# EAGLE design Noduino-Falcon (EAGLE 6.6.0)
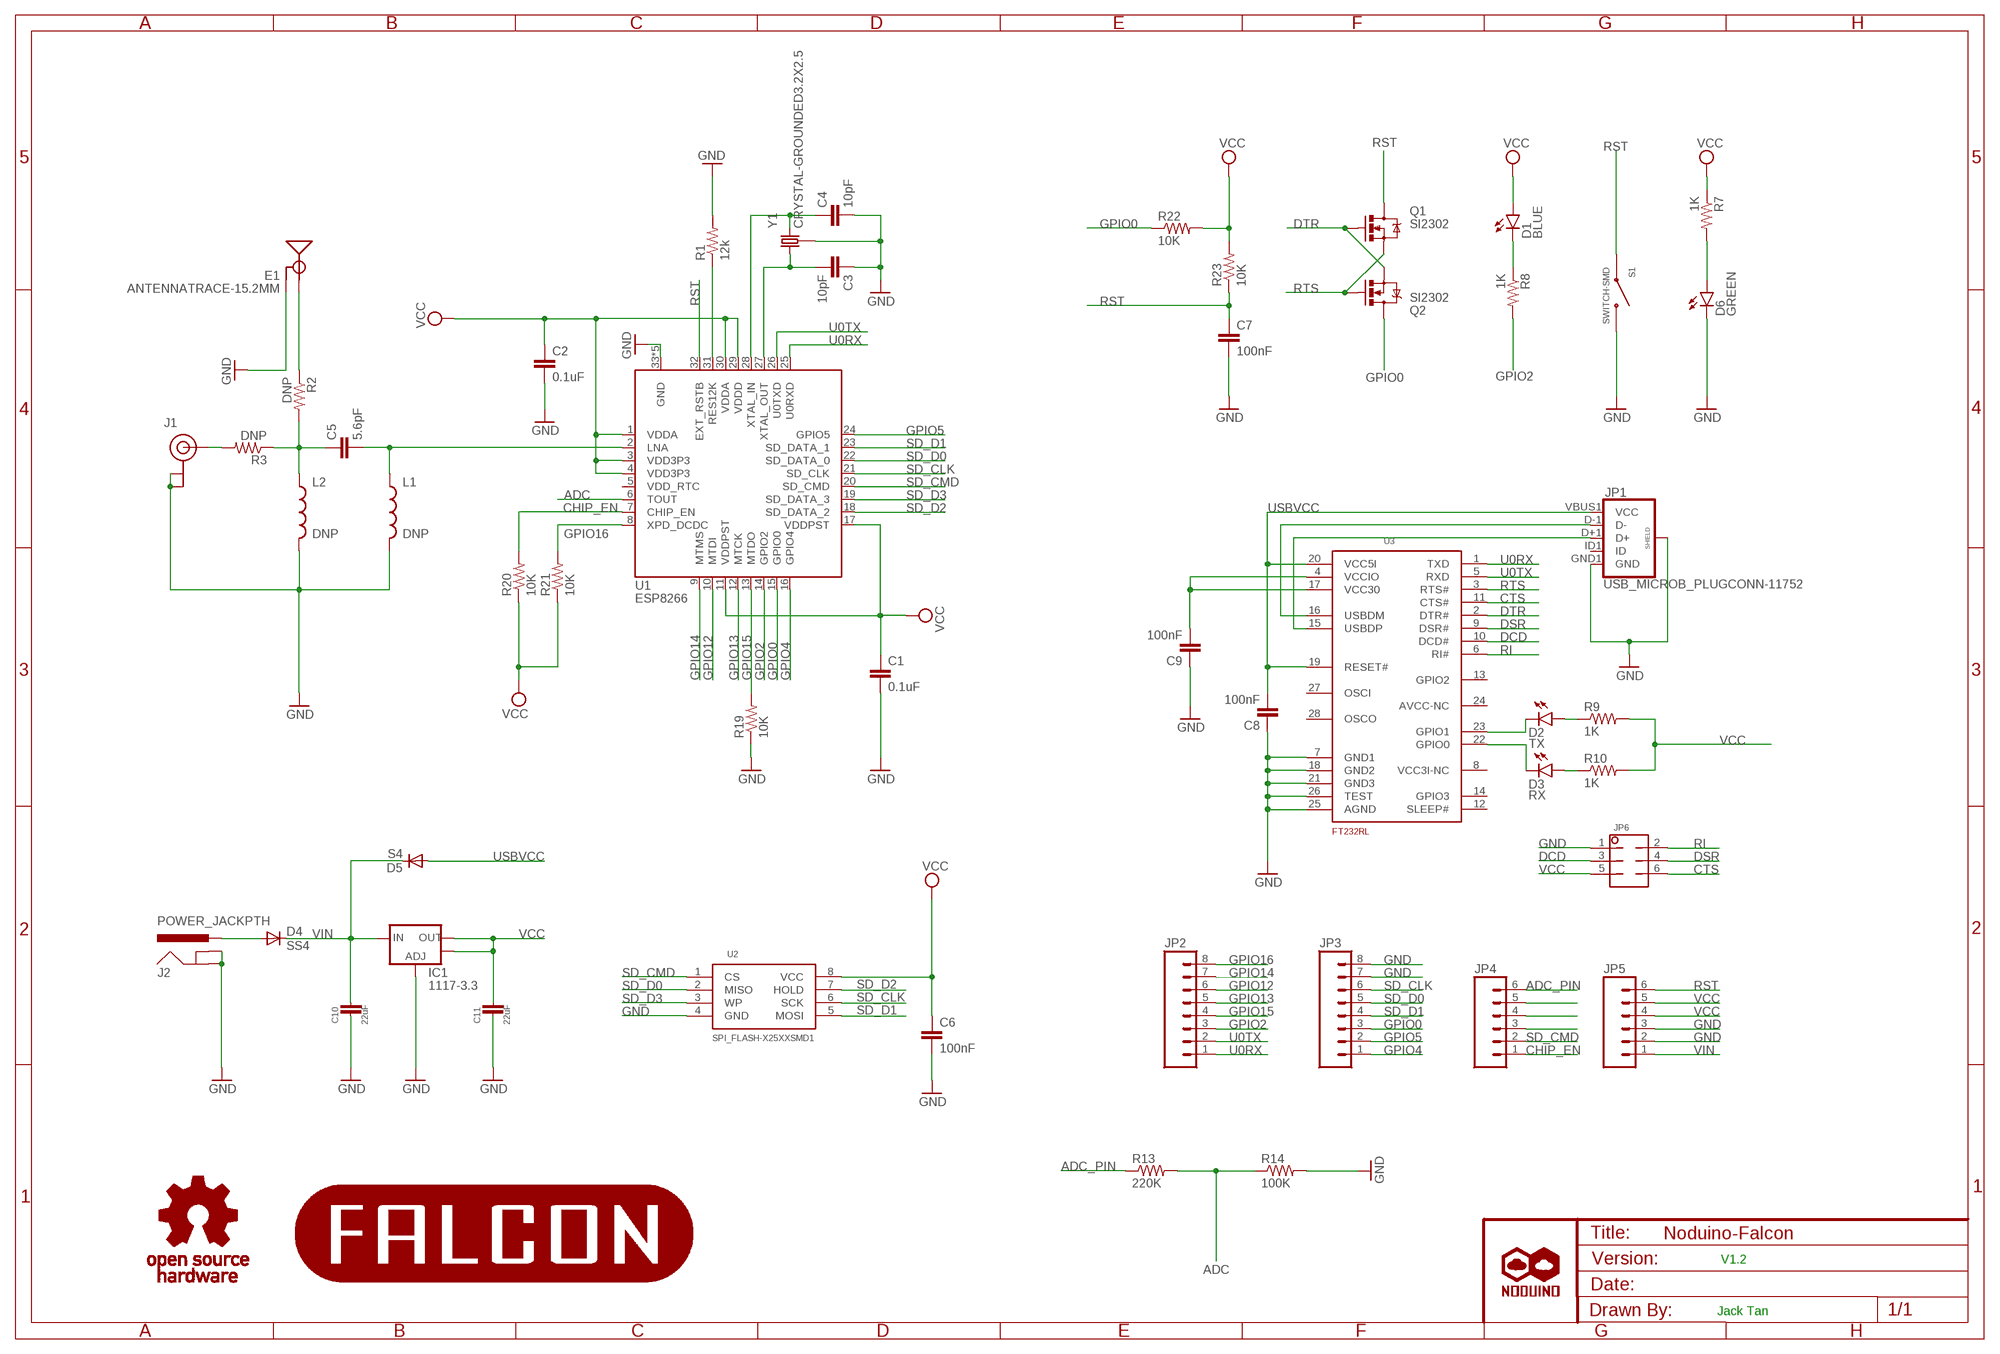
[diagram p0: schematic, sheet 1]

## Parts
C1  0.1uF  0.1UF-25V(+80/-20%)(0603)  [0603-CAP]
C2  0.1uF  0.1UF-25V(+80/-20%)(0603)  [0603-CAP]
C3  10pF  10PF-50V-5%(0603)  [0603-CAP]
C4  10pF  10PF-50V-5%(0603)  [0603-CAP]
C5  5.6pF  CAP0603-CAP  [0603-CAP]
C6  100nF  CAP0603-CAP  [0603-CAP]
C7  100nF  CAP0603-CAP  [0603-CAP]
C8  100nF  CAP0603-CAP  [0603-CAP]
C9  100nF  CAP0603-CAP  [0603-CAP]
C10  22uF  CAP-C1206  [C1206]
C11  22uF  CAP-C1206  [C1206]
D1  BLUE  LED-GREEN0603  [LED-0603]
D2  TX  LED-GREEN0603  [LED-0603]
D3  RX  LED-YELLOW0603  [LED-0603]
D4  SS4  DIODESMB  [SMB-DIODE]
D5  S4  DIODESOD  [SOD-323]
D6  GREEN  LED-GREEN0603  [LED-0603]
E1  ANTENNATRACE-15.2MM  [TRACE_ANTENNA_2.4GHZ_15.2MM]
IC1  1117-3.3  AMS1117SOT223  [SOT223]
J1  U.FL  [U.FL]
J2  POWER_JACKPTH  [POWER_JACK_PTH]
JP1  USB_MICROB_PLUGCONN-11752  [USB-B-MICRO-SMD_V03]
JP2  M081X08  [1X08]
JP3  M081X08  [1X08]
JP4  M06SIP  [1X06]
JP5  M06SIP  [1X06]
JP6  M02X3  [2X3]
L1  DNP  INDUCTOR0603  [0603]
L2  DNP  INDUCTOR0603  [0603]
Q1  SI2302  -MOSFET-N-SMD  [SOT23-3]
Q2  SI2302  -MOSFET-N-SMD  [SOT23-3]
R1  12k  12KOHM-1/10W-1%(0603)  [0603-RES]
R2  DNP  RESISTOR0603-RES  [0603-RES]
R3  DNP  RESISTOR0603-RES  [0603-RES]
R7  1K  RESISTOR0603-RES  [0603-RES]
R8  1K  RESISTOR0603-RES  [0603-RES]
R9  1K  RESISTOR0603-RES  [0603-RES]
R10  1K  RESISTOR0603-RES  [0603-RES]
R13  220K  RESISTOR0603-RES  [0603-RES]
R14  100K  RESISTOR0603-RES  [0603-RES]
R19  10K  RESISTOR0603-RES  [0603-RES]
R20  10K  10KOHM1/10W1%(0603)0603  [0603-RES]
R21  10K  10KOHM1/10W1%(0603)0603  [0603-RES]
R22  10K  RESISTOR0603-RES  [0603-RES]
R23  10K  RESISTOR0603-RES  [0603-RES]
S1  SWITCH-SMD  [TACTILE-SWITCH-1101NE]
U1  ESP8266  [QFN-32]
U2  SPI_FLASH-X25XXSMD1  [SO08-EIAJ]
U3  FT232RL  [SSOP28]
U$1  NODUINO-LOGO-ALL  [NODUINO-ALL-1]
U$2  NODUINO-FALCON  [NODUINO-FALCON]
U$3  OPEN_HARDWARE_LOGO  [OPEN_HARDWARE_LOGO]
Y1  CRYSTAL-GROUNDED3.2X2.5  [CRYSTAL-SMD-3.2X2.5]

## Nets
ADC: R13.2 R14.1 U1.6(TOUT)
ADC_PIN: JP4.6 R13.1
CHIP_EN: JP4.1 R20.2 U1.7(CHIP_EN)
CTS: JP6.6 U3.11(CTS#)
DCD: JP6.3 U3.10(DCD#)
DSR: JP6.4 U3.9(DSR#)
DTR: Q1.1(G) Q2.2(S) U3.2(DTR#)
GND: C1.2 C2.2 C3.1 C4.2 C6.2 C7.2 C8.1 C9.1 C10.2 C11.2 D6.C E1.GND IC1.1(ADJ) J1.P$1(GND) J1.P$2(GND) J2.GND J2.GNDBREAK JP1.GND1(GND) JP1.SHIELD1(SHIELD) JP1.SHIELD2(SHIELD) JP1.SHIELD3(SHIELD) JP3.7 JP3.8 JP5.2 JP5.3 JP6.1 L1.2 L2.2 R1.2 R14.2 R19.1 S1.P$1 U1.33(GND) U1.34(GND) U1.35(GND) U1.36(GND) U1.37(GND) U2.4(GND) U3.7(GND1) U3.18(GND2) U3.21(GND3) U3.25(AGND) U3.26(TEST) Y1.2(GND) Y1.4(GND)
GPIO0: JP3.3 Q2.3(D) R22.1 U1.15(GPIO0)
GPIO2: JP2.3 R8.2 U1.14(GPIO2)
GPIO4: JP3.1 U1.16(GPIO4)
GPIO5: JP3.2 U1.24(GPIO5)
GPIO12: JP2.6 U1.10(MTDI)
GPIO13: JP2.5 U1.12(MTCK)
GPIO14: JP2.7 U1.9(MTMS)
GPIO15: JP2.4 R19.2 U1.13(MTDO)
GPIO16: JP2.8 R21.2 U1.8(XPD_DCDC)
LNA: C5.2 L1.1 U1.2(LNA)
N$1: D1.C R8.1
N$2: C4.1 U1.28(XTAL_IN) Y1.3
N$3: C3.2 U1.27(XTAL_OUT) Y1.1
N$4: JP1.D-1(D-) U3.16(USBDM)
N$5: JP1.D+1(D+) U3.15(USBDP)
N$6: C9.2 U3.4(VCCIO) U3.17(VCC30)
N$7: E1.ANT(SIGNAL) R2.1
N$8: D2.C U3.23(GPIO1)
N$9: D3.C U3.22(GPIO0)
N$10: D2.A R9.1
N$11: D3.A R10.1
N$12: JP4.5
N$13: D6.A R7.2
N$14: JP4.4
N$15: JP4.3
N$16: D4.A J2.PWR
N$17: R1.1 U1.31(RES12K)
N$20: C5.1 L2.1 R2.2 R3.1
N$22: J1.P$3(SIGNAL) R3.2
RI: JP6.2 U3.6(RI#)
RST: C7.1 JP5.6 Q1.3(D) R23.1 S1.P$2 U1.32(EXT_RSTB)
RTS: Q1.2(S) Q2.1(G) U3.3(RTS#)
SD_CLK: JP3.6 U1.21(SD_CLK) U2.6(SCK)
SD_CMD: JP4.2 U1.20(SD_CMD) U2.1(CS)
SD_D0: JP3.5 U1.22(SD_DATA_0) U2.2(MISO)
SD_D1: JP3.4 U1.23(SD_DATA_1) U2.5(MOSI)
SD_D2: U1.18(SD_DATA_2) U2.7(HOLD)
SD_D3: U1.19(SD_DATA_3) U2.3(WP)
U0RX: JP2.1 U1.25(U0RXD) U3.1(TXD)
U0TX: JP2.2 U1.26(U0TXD) U3.5(RXD)
USBVCC: C8.2 D5.2(A) JP1.VBUS1(VCC) U3.19(RESET#) U3.20(VCC5I)
VCC: C1.1 C2.1 C6.1 C11.1 D1.A IC1.2(OUT) IC1.4(OUT) JP5.4 JP5.5 JP6.5 R7.1 R9.2 R10.2 R20.1 R21.1 R22.2 R23.2 U1.1(VDDA) U1.3(VDD3P3) U1.4(VDD3P3) U1.11(VDDPST) U1.17(VDDPST) U1.29(VDDD) U1.30(VDDA) U2.8(VCC)
VIN: C10.1 D4.C D5.1(C) IC1.3(IN) JP5.1
Unconnected: JP1.ID1(ID) U1.5(VDD_RTC) U3.8(VCC3I-NC) U3.12(SLEEP#) U3.13(GPIO2) U3.14(GPIO3) U3.24(AVCC-NC) U3.27(OSCI) U3.28(OSCO)

## Notes on the sheet
- V1.2
- Jack Tan

## Library data of the parts
C1 C2 = SparkFun_ESP8266_Thing:0.1UF-25V(+80/-20%)(0603): CAP-00810 Ceramic Standard decoupling cap; PROD_ID: CAP-00810
C3 C4 = SparkFun_ESP8266_Thing:10PF-50V-5%(0603): CAP-11812; PROD_ID: CAP-11812
C5-C9 = SparkFun_ESP8266_Thing:CAP: Capacitor Standard 0603 ceramic capacitor, and 0.1" leaded capacitor.
C10 C11 = digital-toy:CAP: Capacitor Standard 0603 ceramic capacitor, and 0.1" leaded capacitor.
D1 D2 = SparkFun_ESP8266_Thing:LED-GREEN: Various green LEDs Green LEDs used in SFE Production 0603- DIO-00821 LARGE- DIO-00862 LILYPAD- DIO-09910; PROD_ID: DIO-00821; VALUE: GREEN
D3 = SparkFun_ESP8266_Thing:LED-YELLOW: Yellow SMD LEDs LilyPad 1206- DIO-09909 0603- DIO-09003; PROD_ID: DIO-09003
D4 D5 = ehl:DIODE: Diode These are standard reverse protection diodes and small signal diodes. SMA package can handle up to about 1A. SOD-323 can handle about 200mA. What the SOD-323 package when ordering, there are some mfgs out there that are 5-pin packages.
D6 = SparkFun_ESP8266_Thing:LED-GREEN: Various green LEDs Green LEDs used in SFE Production 0603- DIO-00821 LARGE- DIO-00862 LILYPAD- DIO-09910; PROD_ID: DIO-00821
E1 = SparkFun_ESP8266_Thing:ANTENNA: Chip antenna Chip antenna with ground or secondary connection. Common with larger metal RF connectors.
IC1 = ehl:AMS1117: Voltage Regulator LM1117 Standard adjustable voltage regulator but in SMD form. Spark Fun Electronics SKU : COM-00595
J1 = SparkFun_ESP8266_Thing:U.FL: SMD antenna connector- WRL-09144; PROD_ID: CONN-09193
J2 = ehl:POWER_JACK: Power Jack This is the standard 5.5mm barrel jack for power. The PTH is the most common, proven, reliable, footprint. All others are experimental. The Slot footprint only works if the mill layer is transmitted to the PCB fab house so be warned. Spark Fun Electronics SKU : PRT-00119. Mating wall wart : TOL-00298 (and others)
JP1 = ehl:USB_MICROB_PLUG: USB Micro-B connectors Some male, some female. Watch your step!; PROD_ID: CONN-11752
JP2 JP3 = ehl:M08: Header 8 Standard 8-pin 0.1" header. Use with straight break away headers (SKU : PRT-00116), right angle break away headers (PRT-00553), swiss pins (PRT-00743), machine pins (PRT-00117), and female headers (PRT-00115).
JP4 JP5 = ehl:M06: Header 6 Standard 6-pin 0.1" header. Use with straight break away headers (SKU : PRT-00116), right angle break away headers (PRT-00553), swiss pins (PRT-00743), machine pins (PRT-00117), and female headers (PRT-00115). Molex polarized connector foot print use with SKU : PRT-08094 with associated crimp pins and housings. NOTES ON THE VARIANTS LOCK and LOCK_LONGPADS... This footprint was designed to help hold the alignment of a through-hole component (i.e. 6-pin header) while soldering it into place. You may notice that each hole has been shifted either up or down by 0.005 of an inch from it's more standard position (which is a perfectly straight line). This slight alteration caused the pins (the squares in the middle) to touch the edges of the holes. Because they are alternating, it causes a "brace" to hold the component in place. 0.005 has proven to be the perfect amount of "off-center" position when using our standard breakaway headers. Although looks a little odd when you look at the bare footprint, once you have a header in there, the alteration is very hard to notice. Also, if you push a header all the way into place, it is covered up entirely on the bottom side. This idea of altering the position of holes to aid alignment will be further integrated into the Sparkfun Library for other footprints. It can help hold any component with 3 or more connection pins.
JP6 = ehl:M02X3
L1 L2 = SparkFun_ESP8266_Thing:INDUCTOR: Inductors Basic Inductor/Choke - 0603 and 1206. Footprints are not proven and vary greatly between part numbers. SRN6045- 33uH, 20% 1.4A SDR0403-560KL - 56uH, 10%, 500mA RMS/740mA peak
Q1 Q2 = digital-toy:*-MOSFET-N
R1 = SparkFun_ESP8266_Thing:12KOHM-1/10W-1%(0603): RES-10327; PROD_ID: RES-10327
R2 R3 R7-R10 R13 R14 R19 R22 R23 = SparkFun_ESP8266_Thing:RESISTOR: Resistor Basic schematic elements and footprints for 0603, 1206, and PTH resistors.
R20 R21 = SparkFun_ESP8266_Thing:10KOHM1/10W1%(0603): RES-00824; PROD_ID: RES-00824
S1 = ehl:SWITCH-SMD
U1 = ehl:ESP8266
U2 = ehl:SPI_FLASH-X25XX: 8pin SPI Flash series x25xx. Works with devices like W25X32 and BR25L32
U3 = ehl:FT232RL
U$1 = ehl:NODUINO-LOGO-ALL
U$2 = ehl:NODUINO-FALCON
U$3 = ehl:OPEN_HARDWARE_LOGO
Y1 = SparkFun_ESP8266_Thing:CRYSTAL-GROUNDED

## Board
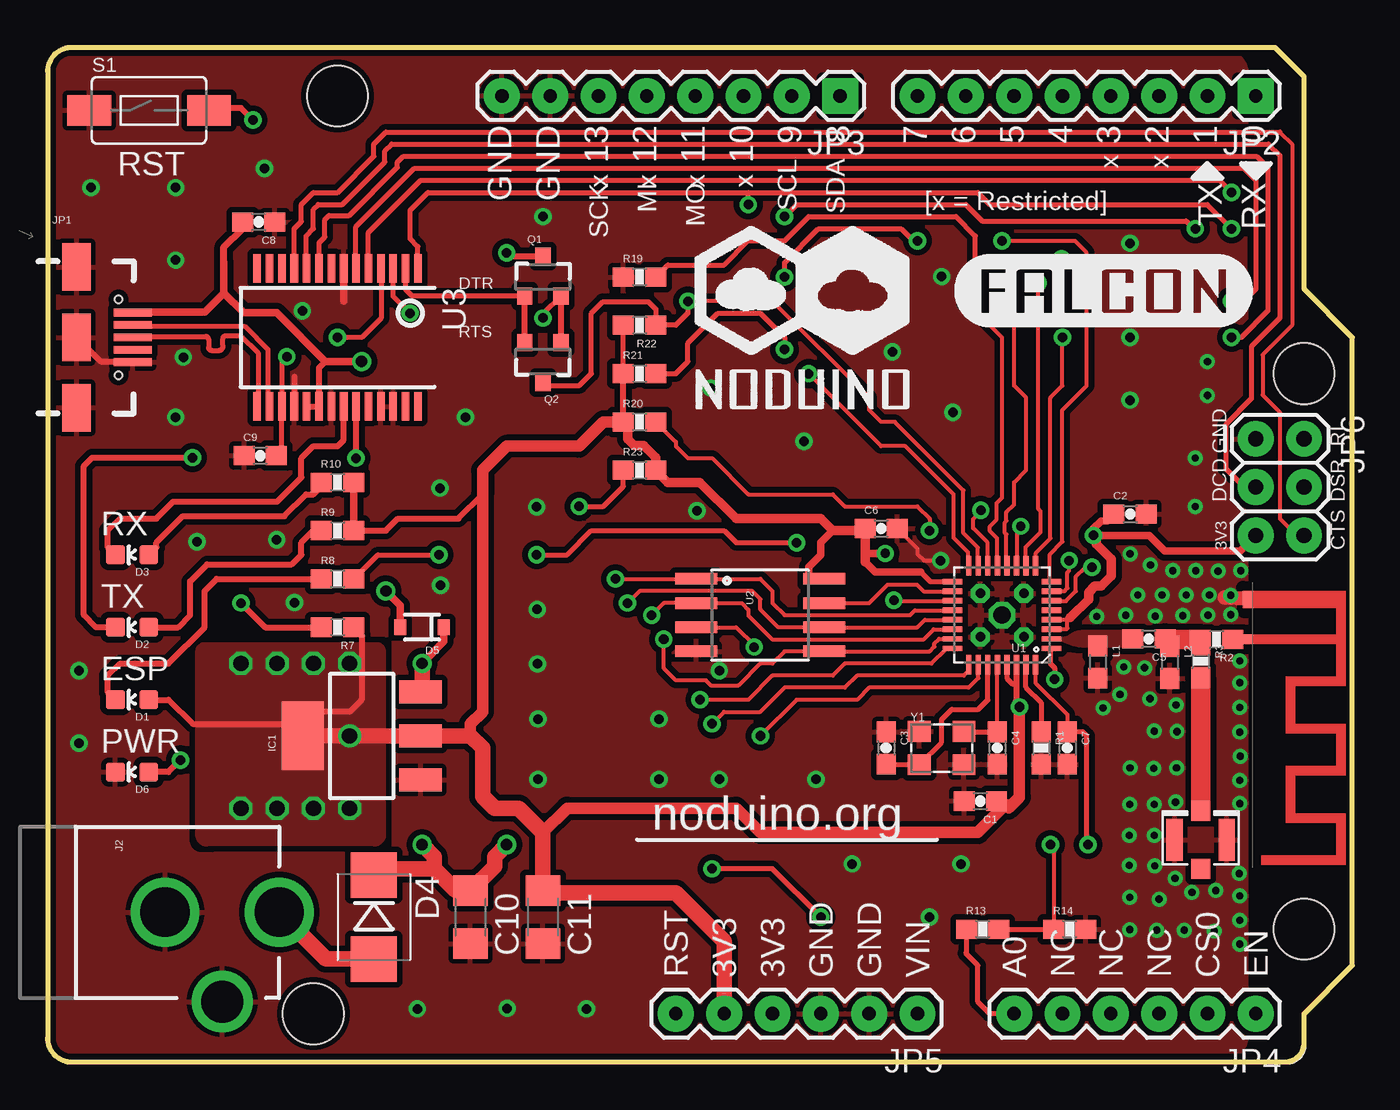
[diagram p1: board, top side]
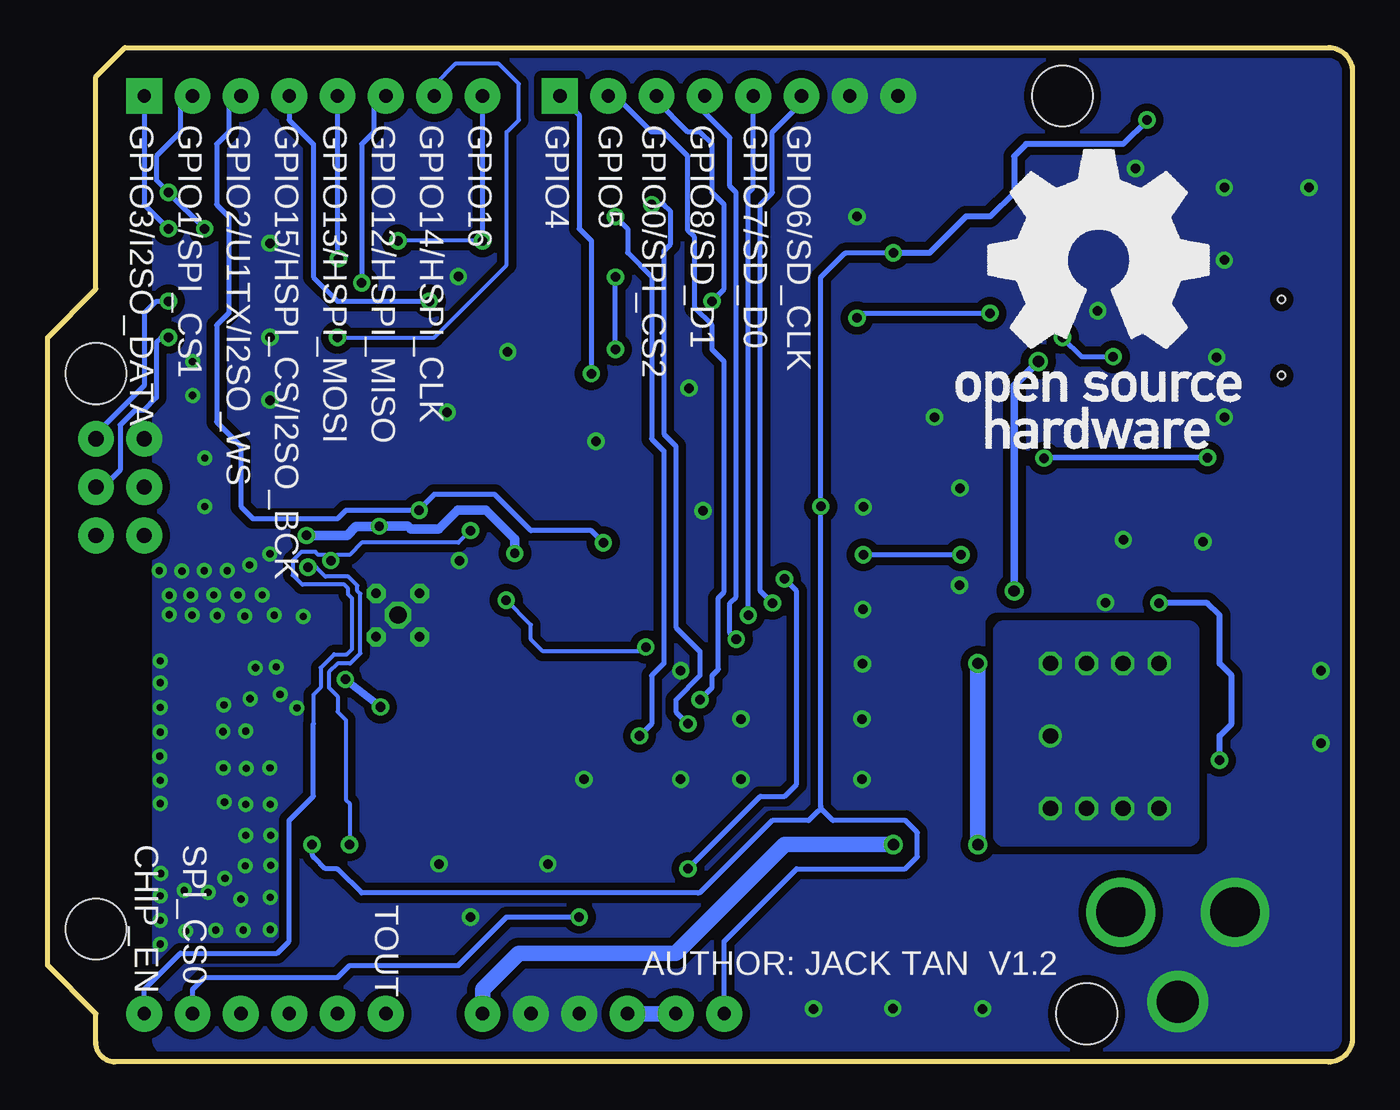
[diagram p2: board, bottom side, seen from below]

Size 68.58 x 53.34 mm. Coordinates in mm from the lower left corner, seen from the top.
Outline: 1.27,0 65.02,0 arc90 66.04,1.02 66.04,2.54 68.58,5.08 68.58,38.1 66.04,40.64 66.04,51.82 64.52,53.34 1.27,53.34 arc90 0,52.07 0,1.27 arc90 1.27,0
Copper layers (1*16): Top 0.035mm / dielectric 1.5mm / Bottom 0.035mm
Design rules "jackslab-camgo *": minimum track width 6mil, minimum drill 12mil, track to track 8mil, track to pad 8mil, pad to pad 8mil, via to via 8mil, smd to smd 6mil, copper to edge 8mil, drill to drill 8mil, minimum pad ring 10mil, minimum via ring 8mil, stop-mask expansion 4mil, vias tented up to drill 20mil, thermal gap 10mil
Holes 3.2 mm at 66.04,6.99 66.04,36.2 15.24,50.8 13.97,2.54

### Footprints (pad centres in the part's own frame; a part is rotated, then mirrored left to right if it is on the bottom)
0603-CAP = smd 1.1 x 1: 1 -0.85,0; 2 0.85,0
C1206 = smd 1.6 x 1.8: 1 -1.4,0; 2 1.4,0
LED-0603 = smd 1 x 1: A 0,-0.877; C 0,0.877
SMB-DIODE = smd 2.4 x 2.4: A 2.2,0; C -2.2,0
SOD-323 = smd 0.63 x 0.83: 1 -1.15,0; 2 1.15,0
TRACE_ANTENNA_2.4GHZ_15.2MM = smd 0.5 x 0.5: ANT 0,-0.25 | smd 0.9 x 0.5: GND -2.1,-0.25
SOT223 = smd 1.219 x 2.235: 1 -2.311,-3.099; 2 0,-3.099; 3 2.311,-3.099 | smd 3.6 x 2.2: 4 0,3.099
U.FL = smd 2.2 x 0.85: P$1 0,1.375; P$2 0,-1.375 | smd 1.05 x 1: P$3 1.525,0; P$4 -1.525,0
POWER_JACK_PTH = drill 2.6: GND 0,7.7; PWR 0,13.7 | drill 2.2: GNDBREAK 4.7,10.7
USB-B-MICRO-SMD_V03 = smd 2 x 0.4: D+1 2.954,0; D-1 2.954,0.65; GND1 2.954,-1.3; ID1 2.954,-0.65; VBUS1 2.954,1.3 | smd 1.5 x 2.5: SHIELD1 0,3.7; SHIELD2 0,-3.7; SHIELD3 0,0 | hole 0.4: 2.2,2; 2.2,-2
1X08 = drill 0.7 pad 1.88 square: 1 0,0 | drill 0.7 pad 1.88: 2 2.54,0; 3 5.08,0; 4 7.62,0; 5 10.16,0; 6 12.7,0; 7 15.24,0; 8 17.78,0
1X06 = drill 0.7 pad 1.88: 1 0,0; 2 2.54,0; 3 5.08,0; 4 7.62,0; 5 10.16,0; 6 12.7,0
2X3 = drill 0.8 pad 1.88: 1 0,0; 2 0,2.54; 3 2.54,0; 4 2.54,2.54; 5 5.08,0; 6 5.08,2.54
0603 = smd 1.1 x 1: 1 -0.85,0; 2 0.85,0
SOT23-3 = smd 0.8 x 0.9: 1 -0.95,-1; 2 0.95,-1; 3 0,1.1
0603-RES = smd 1.1 x 1: 1 -0.85,0; 2 0.85,0
TACTILE-SWITCH-1101NE = smd 2.3 x 1.6: P$1 -3.15,0; P$2 3.15,0
QFN-32 = smd 1.016 x 0.285: 1 -2.602,1.75; 2 -2.602,1.25; 3 -2.602,0.75; 4 -2.602,0.25; 5 -2.602,-0.25; 6 -2.602,-0.75; 7 -2.602,-1.25; 8 -2.602,-1.75; 17 2.602,-1.75; 18 2.602,-1.25; 19 2.602,-0.75; 20 2.602,-0.25; 21 2.602,0.25; 22 2.602,0.75; 23 2.602,1.25; 24 2.602,1.75 | smd 0.285 x 1.016: 9 -1.75,-2.602; 10 -1.25,-2.602; 11 -0.75,-2.602; 12 -0.25,-2.602; 13 0.25,-2.602; 14 0.75,-2.602; 15 1.25,-2.602; 16 1.75,-2.602; 25 1.75,2.602; 26 1.25,2.602; 27 0.75,2.602; 28 0.25,2.602; 29 -0.25,2.602; 30 -0.75,2.602; 31 -1.25,2.602; 32 -1.75,2.602 | drill 0.9 octagon: 33 0,0 | drill 0.5 octagon: 34 -1.143,1.143; 35 1.143,1.143; 36 1.143,-1.143; 37 -1.143,-1.143
SO08-EIAJ = smd 0.61 x 2.21: 1 -1.905,-3.378; 2 -0.635,-3.378; 3 0.635,-3.378; 4 1.905,-3.378; 5 1.905,3.353; 6 0.635,3.353; 7 -0.635,3.353; 8 -1.905,3.353
SSOP28 = smd 0.4 x 1.5: 1 -4.225,-3.625; 2 -3.575,-3.625; 3 -2.925,-3.625; 4 -2.275,-3.625; 5 -1.625,-3.625; 6 -0.975,-3.625; 7 -0.325,-3.625; 8 0.325,-3.625; 9 0.975,-3.625; 10 1.625,-3.625; 11 2.275,-3.625; 12 2.925,-3.625; 13 3.575,-3.625; 14 4.225,-3.625; 15 4.225,3.625; 16 3.575,3.625; 17 2.925,3.625; 18 2.275,3.625; 19 1.625,3.625; 20 0.975,3.625; 21 0.325,3.625; 22 -0.325,3.625; 23 -0.975,3.625; 24 -1.625,3.625; 25 -2.275,3.625; 26 -2.925,3.625; 27 -3.575,3.625; 28 -4.225,3.625
CRYSTAL-SMD-3.2X2.5 = smd 1.2 x 1.1: 1 -1.175,-0.875; 2 1.175,-0.875; 3 1.175,0.875; 4 -1.175,0.875

### Placement (x,y rotation side)
C1  49.02,13.72 180 top
C2  56.9,28.8 0 top
C3  44.07,16.51 270 top
C4  49.91,16.51 270 top
C5  57.89,22.25 180 top
C6  43.81,28.04 0 top
C7  53.59,16.51 270 top
C8  11.1,44.17 180 top
C9  11.18,31.88 0 top
C10  22.23,7.62 270 top
C11  26.04,7.62 270 top
D1  4.45,19.05 90 top
D2  4.45,22.86 90 top
D3  4.45,26.67 90 top
D4  17.14,7.62 270 top
D5  19.68,22.86 180 top
D6  4.45,15.24 90 top
E1  63.32,22.23 270 top
IC1  16.51,17.14 90 top
J1  60.6,11.68 90 top
J2  -1.52,7.87 270 top
JP1  1.52,38.1 0 top
JP2  63.5,50.8 180 top
JP3  41.66,50.8 180 top
JP4  63.5,2.54 180 top
JP5  45.72,2.54 180 top
JP6  63.5,32.77 270 top
L1  55.19,21.03 270 top
L2  58.98,21.01 270 top
Q1  26.04,41.27 0 top
Q2  26.04,36.83 180 top
R1  52.22,16.51 270 top
R2  61.44,22.23 180 top
R3  60.6,21.07 270 top
R7  15.24,22.86 180 top
R8  15.24,25.4 0 top
R9  15.24,27.94 0 top
R10  15.24,30.48 0 top
R13  49.15,6.99 0 top
R14  53.72,6.99 0 top
R19  31.11,41.27 0 top
R20  31.11,33.66 0 top
R21  31.11,36.2 0 top
R22  31.11,38.73 180 top
R23  31.11,31.11 0 top
S1  5.33,50.04 0 top
U1  50.16,23.5 180 top
U2  37.47,23.5 270 top
U3  15.24,38.1 180 top
U$1  33.66,33.66 0 top
U$2  47.68,38.64 0 top
U$3  20.82,32.24 0 bottom
Y1  46.99,16.51 0 top

### Tracks (layer width: path | path; a pad name or v marks a point on that pad's centre or on a via)
ADC  (via drill 0.5)
  Top 0.203: 52.65,24.23 arc-45 U1.6 52.63,24.26 52.65,24.23 53.52,24.23 54.05,24.77 54.05,25.53 54.53,26.01 v54.89,26.01 54.86,25.98 | v52.7,11.43 52.87,11.26 R14.1
  Top 0.254: R13.2 R14.1
  Bottom 0.203: v52.7,11.43 52.7,13.59 52.91,13.79 52.91,17.98 53.34,18.41 53.34,19.23 53.8,19.68 53.8,20.5 53.34,20.95 52.68,20.95 52.15,21.49 52.15,24.61 52.3,24.77 52.3,25.04 52.78,25.53 53.98,25.53 54.46,26.01 v54.89,26.01 54.71,26.01
ADC_PIN
  Top 0.254: JP4.6 49.53,2.54 48.9,3.17 48.9,5.08 48.26,5.71 48.3,5.75 R13.1
CHIP_EN  (via drill 0.5)
  Top 0.203: R20.2 33.02,32.6 33.02,32.38 33.66,31.75 34.92,31.75 36.83,29.84 41.27,29.84 41.91,29.21 45.72,29.21 46.35,28.57 v46.35,27.94 | 52.63,24.77 U1.7 53.42,24.75 53.59,24.92 53.59,25.73 53.7,25.83 v53.7,26.36
  Bottom 0.203: v46.35,27.94 46.99,27.3 52.07,27.3 52.7,26.67 53.34,26.67 53.65,26.36 v53.7,26.36 54,26.67 54.36,26.67 54.51,26.82 55.24,26.82 55.7,26.36 55.7,25.6 55.19,25.09 52.98,25.09 52.78,24.89 52.78,24.59 52.58,24.38 52.58,21.72 52.86,21.44 53.52,21.44 54.23,20.73 54.23,19.68 54.61,19.3 54.61,17.78
  Bottom 0.254: JP4.1 63.5,3.81 61.59,5.71 56.52,5.71 55.88,6.35 55.88,12.7 54.61,13.97 54.61,17.78
CTS
  Top 0.203: 64.77,48.9 65.41,48.26 65.41,38.73 63.86,37.19 63.86,35.08 64.77,34.16 64.77,28.57 65.66,27.69
  Top 0.254: U3.11 12.95,43.81 13.34,44.2 13.34,45.09 13.97,45.72 15.24,45.72 17.14,47.62 17.14,48.26 17.78,48.9 64.77,48.9 | 65.66,27.69 JP6.6
DCD
  Top 0.254: U3.10 13.59,41.75 13.59,43.43 13.97,43.81 13.97,44.83 14.22,45.09 15.49,45.09 17.73,47.32 17.73,47.9 18.09,48.26 64.16,48.26 64.77,47.68 64.77,39.12 63.27,37.62 63.27,34.87 61.92,33.53 61.92,31.19 62.89,30.23 JP6.3
DSR  (via drill 0.5)
  Top 0.254: U3.9 14.28,43.08 14.58,43.38 14.58,44.3 14.78,44.5 15.85,44.5 18.39,47.04 18.39,47.32 18.69,47.62 63.55,47.62 64.14,47.04 64.14,39.5 62.74,38.1 v62.23,38.1
  Bottom 0.254: JP6.4 65.66,30.23 64.77,31.11 64.77,33.5 63.98,34.29 63.5,34.29 62.87,34.92 62.87,37.85 62.61,38.1 v62.23,38.1
DTR
  Top 0.254: Q1.1 25.07,40.26 19.18,40.26 18.82,40.62 U3.2
  Top 0.305: Q2.2 Q1.1
GND  (via drill 0.38, 0.5)
  Top 0.203: C6.2 45.72,26.99 45.72,26.72 46.08,26.36 v46.94,26.36
  Top 0.305: JP1.SHIELD3 2.79,36.83 3.81,36.83 3.84,36.8 JP1.GND1 | E1.GND 63.09,24.36 | 12.96,36.03 U3.18
  Top 0.406: U3.7 15.57,40.01
  Top 0.61: 61.87,24.43 v62.18,24.54
  Top 0.762: 63.09,24.36 61.87,24.43
  other vias: 35.31,20.57 56.9,43.05 56.9,38.1 56.9,34.8 26.04,44.45 62.71,25.83 62.66,21.08 62.66,19.94 62.66,18.64 62.66,17.35 62.69,16.08 62.64,9.91 62.66,8.74 61.39,9.02 60.15,8.92 56.87,8.66 56.85,10.34 56.87,13.54 58.14,15.44 55.47,18.62 59.36,17.37 62.18,23.52 60.35,25.83 59.13,25.83 61.52,25.81 60.33,29.21 60.33,31.75 60.96,35.05 60.96,36.83 44.4,37.34 47.57,34.16 46.99,41.3 6.73,42.16 6.73,33.91 7.14,37.06 11.4,46.99 21.97,33.91 25.73,23.8 25.76,20.93 28.32,2.79 1.65,20.57 1.65,16.76 12.04,27.46 7.85,27.36 12.98,24.16 20.65,25.07 20.62,30.18 32.13,18.03 25.78,18.03 25.78,14.86 32.13,14.86 35.31,14.86 40.39,14.86 42.29,10.41 48.01,10.41 39.75,32.64 19.43,2.79 59.33,15.47 58.17,17.4 56.9,15.47 58.17,13.54 56.85,11.91 58.17,11.91 58.19,10.31 56.87,6.96 58.29,6.93 61.32,6.88 62.66,7.44 57.96,26.14 56.9,26.72 62.66,14.81 62.66,13.59 62.66,6.2 61.06,24.56 60.99,23.5 59.84,24.56 59.66,23.47 57.3,24.56 58.57,24.56 56.67,23.5 58.22,23.44 56.57,20.78 57.66,20.73 59.31,18.77 59.28,13.67 56.36,19.33 57.94,19.1 55.14,23.42 59.74,6.93 59.26,9.65 58.42,8.56 13.39,39.5 2.29,45.97 6.73,45.97 24.16,2.82 25.7,29.18 34.87,35.43 46.35,7.62 34.14,28.98
  pour Top (isolate 0.406, rank 2): 0.25,51.82 0.25,52.07 arc-90 1.27,53.09 61.98,53.09 arc-90 62.99,52.07 62.99,1.27 arc-90 61.98,0.25 1.27,0.25 arc-90 0.25,1.27
  pour Top (isolate 0.305, rank 2): 0.25,44.7 0.25,52.07 arc-90 1.27,53.09 61.98,53.09 arc-90 62.99,52.07 62.99,1.27 arc-90 61.98,0.25 1.27,0.25 arc-90 0.25,1.27
  pour Bottom (isolate 0.406, rank 2, no thermals): 61.98,53.09 arc-90 62.99,52.07 62.99,49.28 62.99,1.27 arc-90 61.98,0.25 61.47,0.25 0,0.25 arc-90 -1.02,1.27 -1.02,15.49 -1.02,46.99 -1.02,52.58 arc-90 -0.25,53.09
GPIO0  (via drill 0.5)
  Top 0.203: U1.15 48.9,25.96 48.9,27.05 48.13,27.81 48.13,30.05 44.53,33.66 43.81,33.66 43.18,34.29 43.18,34.92 38.1,40.01 v33.66,40.01
  Top 0.254: Q2.3 26.2,35.56 27.94,35.56 28.57,36.2 28.57,39.37 29.18,39.98 31.57,39.98 31.96,39.59 R22.1 33.02,38.73 33.66,39.37 v33.66,40.01
  Bottom 0.254: v33.66,40.01 33.02,40.64 33.02,45.09 33.66,45.72 33.66,48.26 34.29,48.9 34.92,48.9 36.58,50.55 JP3.3
GPIO2  (via drill 0.5)
  Top 0.203: U1.14 49.4,25.96 49.4,27.3 48.64,28.07 48.64,28.55 49.05,28.96 v49.05,29.01
  Top 0.254: R8.2 17.36,26.67 v20.57,26.67 | v39.37,27.3 36.2,27.3 35.56,27.94 28.57,27.94 27.3,26.67 v25.7,26.67
  Bottom 0.254: v39.37,27.3 40.01,27.94 43.18,27.94 45.09,29.84 48.26,29.84 49.02,29.08 v49.05,29.01 52.91,29.01 53.34,28.57 57.78,28.57 58.42,29.21 58.42,32.38 59.69,33.66 59.69,38.73 59.05,39.37 59.05,44.45 59.69,45.09 59.69,48.26 59.05,48.9 59.05,50.16 JP2.3 | v20.57,26.67 v25.7,26.67
GPIO4  (via drill 0.5)
  Top 0.203: U1.16 48.39,25.97 48.39,26.8 47.62,27.56 47.62,29.84 45.09,32.38 43.81,32.38 v40.01,36.2
  Bottom 0.254: JP3.1 40.64,49.78 40.64,43.81 40.01,43.18 v40.01,36.2
GPIO5  (via drill 0.5)
  Top 0.203: v34.29,19.05 36.83,19.05 38.1,20.32 41.27,20.32 41.91,20.95 46.46,20.95 47.25,21.75 U1.24
  Bottom 0.254: v34.29,19.05 33.66,19.68 33.66,20.32 33.33,20.65 33.33,24.41 33.02,24.71 33.02,36.83 33.66,37.47 33.66,38.73 34.57,39.65 34.57,43.36 34.92,43.71 34.92,47.62 36.2,48.9 36.83,48.9 38.73,50.8 JP3.2
GPIO12  (via drill 0.5)
  Top 0.203: U1.10 51.44,25.96 51.41,25.99 51.41,27.08 52.2,27.86 52.2,28.96 52.07,29.08 v52.07,40.97
  Bottom 0.254: JP2.6 51.44,50.16 51.44,48.9 52.07,48.26 v52.07,40.97
GPIO13  (via drill 0.5)
  Top 0.203: U1.12 50.42,25.95 50.39,25.97 50.39,27.74 50.32,27.81 50.32,28.37 50.39,28.45 50.39,28.91 50.8,29.31 50.8,30.48 51.44,31.11 51.44,34.92 50.8,35.56 50.8,41.91 51.13,42.24 v53.29,42.24
  Bottom 0.203: v53.29,42.24 53.34,42.29
  Bottom 0.254: 53.34,42.29 JP2.5
GPIO14  (via drill 0.5)
  Top 0.203: U1.9 51.94,25.97 51.94,26.77 52.7,27.53 52.7,34.92 53.34,35.56 v53.34,38.1
  Bottom 0.203: v53.34,38.1 48.26,38.1 44.45,41.91 44.45,48.9 43.81,49.53 43.81,51.44 44.86,52.48 47.14,52.48 48.26,51.36 JP2.7
GPIO15  (via drill 0.5)
  Top 0.203: U1.13 49.91,25.95 49.91,27.53 49.53,27.91 49.53,28.17 49.89,28.52 49.89,29.39 50.16,29.67 50.16,38.1 48.51,39.75 v48.51,40.01
  Top 0.254: R19.2 32.6,41.91 35.56,41.91 36.83,43.18 38.73,43.18 40.01,44.45 47.75,44.45 48.77,43.43 48.77,40.26 v48.51,40.01
  Bottom 0.254: JP2.4 55.88,49.53 54.61,48.26 54.61,41.27 53.34,40.01 v48.51,40.01
GPIO16  (via drill 0.5)
  Top 0.152: U1.8 52.68,25.25 52.68,25.36
  Top 0.203: v50.16,43.18 53.98,43.18 54.61,42.55 54.61,35.56 53.34,34.29 53.34,27.36 52.68,26.7 52.68,25.36 52.7,25.34
  Top 0.254: R21.2 33.02,36.2 33.66,36.83 33.66,37.8 35.23,39.37 37.47,39.37 38.73,38.1 v38.73,37.47 | v38.73,41.27 38.73,42.04 40.51,43.81 44.86,43.81 45.49,43.18 v45.72,43.18
  Bottom 0.203: v45.72,43.18 v50.16,43.18
  Bottom 0.254: v45.72,43.18 JP2.8 | v38.73,37.47 v38.73,41.27
LNA
  Top 0.254: C5.2 57.15,22.19 | U1.2 52.69,22.25
  pour Top (no thermals): 52.96,22.35 53.31,22.35 arc37 53.77,22.5 arc-38 54.41,22.71 57.12,22.71 arc-183 57.1,21.79 54.56,21.79 arc-29 53.26,22.12 arc47 52.98,22.15 arc-202
N$1
  Top 0.305: R8.1 8.89,25.4 8.26,24.77 8.26,22.86 6.35,20.95 3.81,20.95 3.17,20.32 3.17,19.44 D1.C
N$2
  Top 0.203: 49.91,17.14 U1.28
  Top 0.254: Y1.3 48.19,17.36 C4.1 49.91,17.14
N$3
  Top 0.254: C3.2 43.84,15.63 Y1.1 46.99,16.81 46.99,18.01 47.52,18.54 48.92,18.54 49.41,19.04 U1.27
N$4
  Top 0.203: 4.24,38.73 4.34,38.68 | 11.58,35.13 11.66,35.05 U3.16
  Top 0.254: 4.34,38.68 10.36,38.68 11.58,37.47 11.58,35.13
  Top 0.305: JP1.D-1 4.24,38.73
N$5
  Top 0.203: JP1.D+1 4.58,38.2 4.61,38.18
  Top 0.254: U3.15 11.02,35.15 11.07,35.2 11.07,37.26 10.16,38.18 9.35,38.18 arc90 9.22,38.05 9.22,37.67 arc-90 9.02,37.41 8.64,37.41 arc-90 8.46,37.57 8.46,38 arc90 8.31,38.15 4.79,38.15 arc90 4.74,38.1 arc-45 4.64,38.15 4.61,38.18
N$6  (via drill 0.5)
  Top 0.254: U3.4 17.53,41.71 17.53,39.12 16.51,38.1 v15.24,38.1 | v12.57,37.08 12.31,36.83 U3.17 12.31,32.17 C9.2
  Bottom 0.254: v15.24,38.1 14.22,37.08 v12.57,37.08
N$7
  Top 0.406: E1.ANT R2.1
N$8  (via drill 0.5)
  Top 0.305: D2.C 2.54,22.86 1.91,23.5 1.91,31.34 2.34,31.77 v7.62,31.77 | v16.2,31.75 16.21,32.68 U3.23
  Bottom 0.305: v7.62,31.77 v16.2,31.75
N$9
  Top 0.305: D3.C 3.17,27.06 3.17,27.94 3.81,28.57 5.71,28.57 6.6,29.46 12.06,29.46 13.34,30.73 13.34,31.75 13.97,32.38 15.24,32.38 15.56,32.71 U3.22
N$10
  Top 0.305: D2.A 6.86,22.86 7.49,23.5 7.49,25.27 8.38,26.16 12.83,26.16 13.34,26.67 13.34,27.3 13.97,27.94 R9.1
N$11
  Top 0.254: 13.97,30.48 R10.1
  Top 0.305: D3.A 5.71,27.06 5.71,27.3 7.11,28.7 12.45,28.7 13.59,29.84 13.97,29.84 14.39,30.27 R10.1
N$13  (via drill 0.5)
  Top 0.305: D6.A 6.35,15.24 v6.99,15.88 | v10.16,24.13 11.43,22.86 R7.2
  Bottom 0.305: v6.99,15.88 6.99,17.14 6.35,17.78 6.35,20.32 6.99,20.95 6.99,23.5 7.62,24.13 v10.16,24.13
N$16
  Top 0.813: J2.PWR 14.63,5.42 D4.A
N$17
  Top 0.254: U1.31 51.41,19.7 52.22,18.9 R1.1
N$20
  Top 0.61: C5.1 58.98,22.03
  Top 1.016: 58.98,22.03 L2.1 | C5.1 arc90 58.76,22.23 R2.2 arc-90 60.6,22.19 R3.1
N$22
  Top 1.016: R3.2 J1.P$3
RI  (via drill 0.5)
  Top 0.254: U3.6 16.2,43.92 19.28,46.99 62.87,46.99 63.5,46.35 63.5,40.64 62.87,40.01 v62.23,40.01
  Bottom 0.254: JP6.2 66.04,33.02 63.5,35.56 63.5,39.37 62.87,40.01 v62.23,40.01
RST  (via drill 0.5)
  Top 0.203: U1.32 51.92,19.94 53.59,18.26 C7.1
  Top 0.254: v27.94,29.21 29.21,29.21 30.27,30.27 R23.1 | v54.69,11.43 54.61,11.51 54.61,17.14 54.4,17.36 C7.1
  Top 0.305: 26.2,42.55 Q1.3 24.3,42.38 v24.13,42.55 | S1.P$2 8.61,50.16 10.16,50.16 v10.79,49.53
  Bottom 0.254: JP5.6 33.02,6.35 29.21,10.16 23.5,10.16 22.86,10.79 22.86,12.06 23.5,12.7 27.3,12.7 27.87,13.26 | 23.5,42.55 26.57,42.55 arc-45 26.74,42.47 27.94,41.27 v27.94,29.21 27.94,13.44 arc-45 27.87,13.26 | 27.87,13.26 27.91,13.26 arc-45 28.09,13.19 28.57,12.7 30.48,12.7 34.22,8.96 arc45 34.4,8.89 52.07,8.89 53.27,10.09 arc-45 53.45,10.16 53.98,10.16 54.54,10.72 arc45 54.69,11 v54.69,11.43
  Bottom 0.305: v10.79,49.53 12.06,48.26 17.14,48.26 17.78,47.62 17.78,45.72 19.05,44.45 20.32,44.45 22.23,42.55 23.5,42.55 v24.13,42.55
RTS  (via drill 0.5)
  Top 0.254: Q1.2 26.04,39.33 v26.04,39.12 | v19.05,39.37 18.16,40.26 U3.3
  Top 0.305: Q2.1 Q1.2
  Bottom 0.254: v26.04,39.12 25.78,39.37 v19.05,39.37
SD_CLK  (via drill 0.5)
  Top 0.203: U1.21 46.1,23.25 45.72,22.86 U2.6 38.41,22.86 37.47,23.8 37.47,24.33 37.03,24.77 31.11,24.77 v30.48,24.13
  Bottom 0.254: v30.48,24.13 31.11,24.77 31.11,45.09 30.48,45.72 30.48,48.9 28.96,50.42 JP3.6
SD_CMD  (via drill 0.5)
  Top 0.203: U1.20 45.59,23.75 45.34,23.5 38.73,23.5 38.1,24.13 38.1,24.77 37.47,25.4 U2.1 v29.84,25.4
  Top 0.254: v40.64,7.62 38.1,10.16 v34.92,10.16
  Bottom 0.254: JP4.2 60.96,3.81 60.33,4.45 53.34,4.45 52.7,5.08 46.99,5.08 44.45,7.62 v40.64,7.62 | v34.92,10.16 31.11,13.97 29.84,13.97 29.21,14.61 29.21,24.77 v29.84,25.4
SD_D0  (via drill 0.5)
  Top 0.203: U1.22 46.57,22.75 46.05,22.23 38.08,22.23 36.83,23.47 36.83,23.77 36.47,24.13 U2.2 32.38,24.13 v31.75,23.5
  Bottom 0.203: 31.5,50.55 JP3.5
  Bottom 0.254: v31.75,23.5 31.75,45.72 31.5,45.97 JP3.5
SD_D1  (via drill 0.5)
  Top 0.203: v32.38,22.23 32.38,20.7 33.02,20.07 34.59,20.07 34.85,19.81 36.32,19.81 37.47,20.95 38.1,20.95 38.73,21.59 39.93,21.59 40.01,21.51 U2.5 46.35,21.59 46.61,21.84 46.61,22 46.86,22.25 U1.23
  Bottom 0.254: v32.38,22.23 32.72,22.55 32.72,24.13 32.38,24.46 32.38,45.72 32.72,46.05 32.72,48.59 34.04,49.91 JP3.4
SD_D2
  Top 0.203: U2.7 43.18,24.13 44.15,25.09 45.7,25.09 46.05,24.75 U1.18
SD_D3  (via drill 0.5)
  Top 0.203: U2.3 36.2,22.86 37.13,21.92 v37.13,21.82 | v44.48,24.28 44.56,24.25 U1.19
  Bottom 0.203: v37.13,21.82 37.47,21.59 42.55,21.59 43.18,22.23 43.18,22.99 v44.48,24.28
U0RX  (via drill 0.5)
  Top 0.203: v34.92,17.78 35.56,18.41 37.47,18.41 38.73,19.68 41.91,19.68 42.55,20.32 48.16,20.32 48.41,20.58 U1.25
  Top 0.254: U3.1 19.46,42.88 19.05,43.28 19.05,44.78 19.99,45.72 36.83,45.72 | 36.83,45.72 48.9,45.72 49.53,45.09 60.96,45.09 v62.23,43.81 | v36.83,45.09 36.83,45.72
  Bottom 0.254: JP2.1 63.5,45.09 v62.23,43.81 | v36.83,45.09 36.2,45.09 35.87,44.76 35.87,42.98 36.2,42.65 36.2,33.02 35.56,32.38 35.56,22.86 34.29,21.59 34.29,20.32 35.56,19.05 35.56,18.41 v34.92,17.78
U0TX  (via drill 0.5)
  Top 0.203: 48.9,21.02 U1.26 48.91,20.19 48.41,19.68 43.18,19.68 42.55,19.05 39.37,19.05 v37.47,17.14
  Top 0.254: U3.5 16.87,43.61 19.61,46.35 61.59,46.35 v62.23,45.72 | v38.73,44.45 39.37,45.09 48.26,45.09 49.12,44.22 59.84,44.22 60.25,43.81 v60.33,43.81
  Bottom 0.254: JP2.2 61.59,50.16 61.59,48.9 62.87,47.62 62.87,46.35 v62.23,45.72 v60.33,43.81 | v38.73,44.45 38.1,43.81 38.1,42.55 36.83,41.27 36.83,32.77 36.2,32.13 36.2,20.95 36.83,20.32 36.83,17.78 v37.47,17.14
USBVCC  (via drill 0.6)
  Top 0.254: JP1.VBUS1 4.25,39.42
  Top 0.305: 14.61,36.83 14.27,36.49 U3.20 U3.19
  Top 0.381: 9.27,42.06 9.27,42.85 10.25,43.83 C8.2
  Top 0.406: v16.51,36.83 14.61,36.83 12.04,39.4 10.31,39.4 9.27,40.44 | 4.25,39.42 8.26,39.42 9.27,40.44 | v17.78,24.77 18.54,24.01 D5.2 | 9.27,42.06 9.27,40.44
  Bottom 0.406: v16.51,36.83 17.78,35.56 v17.78,24.77
VCC  (via drill 0.48, 0.5, 0.81)
  Top 0.152: 52.93,23.24 52.96,23.27 | 53.7,23.44 53.75,23.37 | 52.65,22.73 52.68,22.76 | 55.22,27.69 55.12,27.69
  Top 0.203: 52.63,22.76 52.65,22.73 | 50.93,25.96 50.95,25.98 50.95,27.76 51.16,27.96 v51.16,28.17 | v44.02,26.75 43.89,26.67 43.81,26.67 | 42.97,26.67 43.09,26.75 | 52.96,23.27 53.52,23.27 53.59,23.34 | 53.59,23.34 53.7,23.44 | 52.68,22.76 53.54,22.76 53.59,22.81 53.59,23.34 | C1.1 50.86,13.72 50.51,13.35
  Top 0.254: U1.3 52.63,22.76 | U1.4 52.62,23.24 52.93,23.24 53.01,23.24 | R21.1 R22.2 | R20.1 30.48,33.44 | U1.17 47.71,25.25 46.41,25.25 45.9,25.76 | U1.11 50.93,25.96 | U1.1 52.7,21.66 52.7,20.95 52.93,20.73 v52.93,20.12 | 42.55,27.94 42.65,28.04 C6.1 | U1.29 50.42,20.87 50.42,20.17 50.7,19.89 50.91,19.89
  Top 0.305: D1.A 6.35,19.05 7.62,17.78 13.34,17.78 | 13.34,17.78 13.97,17.78 13.41,17.22 IC1.4 | 13.34,17.78 13.34,18.41 15.88,18.41 16.51,19.05 16.51,22.44 R7.1 | 30.48,36.2 R21.1 R20.1 | U2.8 40.01,25.48 | v54.97,27.69 54.91,27.74 | U1.30 50.91,19.89 50.91,18.93 | R9.2 17.78,27.94 18.41,28.57 21.59,28.57 22.86,29.84
  Top 0.406: 40.01,25.48 40.01,26.04 40.64,26.67 40.64,27.3 41.27,27.94 | 45.9,25.76 43.51,25.76 42.97,26.3 | JP6.5 62.69,26.87 58.73,26.87 57.91,27.69 55.12,27.69 v54.97,27.69 54.97,28.04 55.37,28.45 55.69,28.45 C2.1 | 43.09,26.75 v44.02,26.75 | v51.08,18.67 50.91,18.93 | R10.2 R9.2
  Top 0.508: 30.48,33.44 30.48,32.77 30.84,32.41 31.34,32.41 31.96,31.79 R23.2 32.6,30.48 34.29,30.48 36.2,28.57 40.64,28.57 41.27,27.94 42.55,27.94 | 42.97,26.3 42.97,26.67 C6.1 | 55.12,27.69 55.12,27.23 55.91,26.44 55.91,25.55 55.37,25.02 55.04,25.02 54.71,24.69 54.71,24.31 53.75,23.37
  Top 0.61: 26.04,12.06 27.3,13.34 36.2,13.34 37.47,12.06 48.9,12.06 50.29,13.46 50.51,13.35 51.08,13.92 v51.08,18.67 | R20.1 29.21,33.66 27.94,32.38 24.13,32.38 22.86,31.11 22.86,29.84 22.86,18.41 22.23,17.78 22.23,17.14
  Top 0.813: JP5.5 35.56,6.35 33.02,8.89 26.16,8.89 C11.1 26.04,12.06 24.77,13.34 23.5,13.34 22.86,13.97 22.86,16.51 22.23,17.14 IC1.2 IC1.4
  Bottom 0.203: v51.16,28.17 51.18,28.14
  Bottom 0.254: 52.91,20.09 v52.93,20.12
  Bottom 0.406: v51.08,18.67 52.91,20.09 | v51.16,28.17 50.98,28.19
  Bottom 0.508: 50.98,28.19 49.66,28.19 49.48,28.02 48.03,28.02 47.02,29.03 45.54,29.03 44.02,27.51 v44.02,26.75 | 51.18,28.14 52.38,28.14 52.83,27.69 v54.97,27.69
  Bottom 0.813: JP5.5 JP5.4
  other vias: 10.16,20.95 12.06,20.95 13.97,20.95 15.88,20.95 10.16,13.34 12.06,13.34 13.97,13.34 15.88,13.34 15.88,17.14
  pour Bottom (no thermals): 8.13,12.7 8.13,22.61 arc-90 8.64,23.11 17.53,23.11 18.03,23.11 18.29,23.11 arc-90 18.8,22.61 18.8,18.29 18.8,12.19 18.8,11.94 arc-90 18.29,11.43 8.64,11.43 arc-90 8.13,11.94
  pour Top (no thermals): 7.87,12.7 7.87,21.59 arc-90 8.26,21.97 17.14,21.97 17.3,21.97 arc-90 17.68,21.59 17.68,18.82 17.68,15.39 17.68,14.43 17.68,12.83 17.68,11.96 arc-90 17.14,11.43 8.38,11.43 arc-90 7.87,11.94
VIN  (via drill 0.6, 0.61)
  Top 0.406: v19.68,20.95 20.84,22.11 D5.1
  Top 0.813: IC1.3 19.68,19.53 v19.68,20.95 | D4.C 17.48,10.16 20.32,10.16 | 20.32,10.16 21.46,9.02 C10.1 23.5,10.29 23.5,10.79 v24.13,11.43 | v19.68,11.43 20.32,10.79 20.32,10.16
  Bottom 0.813: v24.13,11.43 29.84,11.43 35.56,5.71 43.81,5.71 45.72,3.81 JP5.1 | v19.68,20.95 v19.68,11.43

### Text on the board
tPlace: GND | GND | 13 | 12 | 11 | 10 | 9 | 8 | 7 | 6 | 5 | 4 | 3 | 2 | 1 | 0 | RST | SCL | SDA | x | x | SCK | x | MI | x | MO | x | x | TX | RX | [x = Restricted] | DTR | RTS | GND | RI | DCD | DSR | RX | 3V3 | CTS | TX | ESP | PWR | noduino.org | RST | 3V3 | 3V3 | GND | GND | VIN | A0 | NC | NC | NC | CS0 | EN
bPlace: GPIO6/SD_CLK | GPIO7/SD_D0 | GPIO8/SD_D1 | GPIO0/SPI_CS2 | GPIO5 | GPIO4 | GPIO16 | GPIO14/HSPI_CLK | GPIO12/HSPI_MISO | GPIO13/HSPI_MOSI | GPIO15/HSPI_CS/I2SO_BCK | GPIO2/U1TX/I2SO_WS | GPIO1/SPI_CS1 | GPIO3/I2SO_DATA | SPI_CS0 | CHIP_EN | TOUT | AUTHOR: JACK TAN V1.2